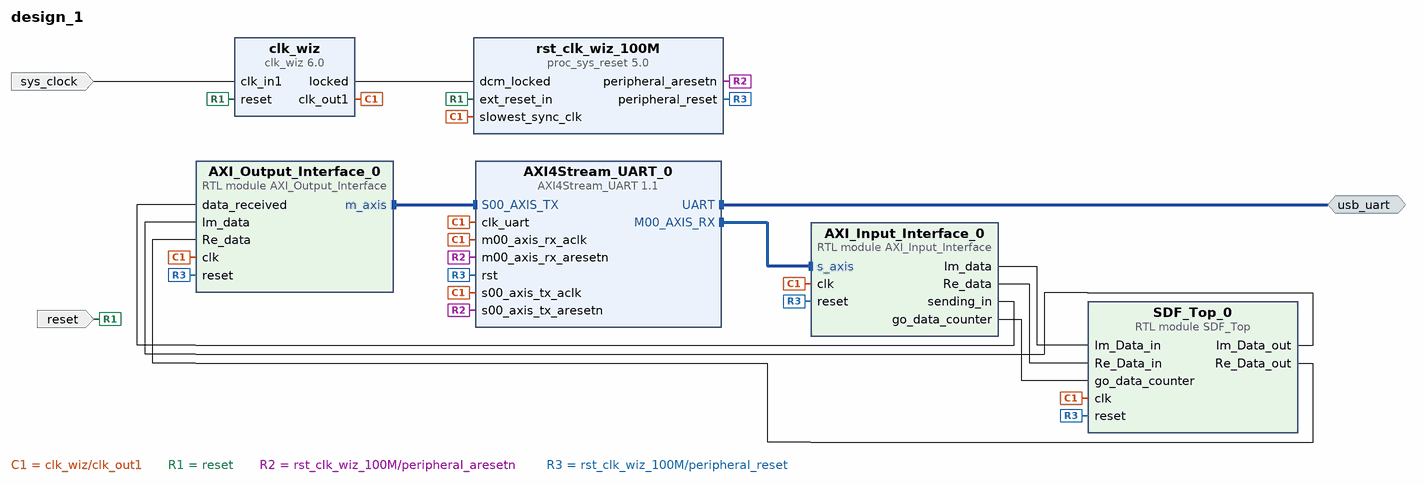
[diagram p0: block diagram of the top level]
# Vivado block design design_1, xc7a35tcpg236-1, Vivado 2022.1
create_bd_design design_1

create_bd_intf_port -mode Master -vlnv xilinx.com:interface:uart_rtl:1.0 usb_uart
create_bd_port -dir I -type clk sys_clock
set_property -dict {CONFIG.FREQ_HZ 100000000 CONFIG.PHASE 0.0} [get_bd_ports sys_clock]
create_bd_port -dir I -type rst reset
set_property -dict {CONFIG.POLARITY ACTIVE_HIGH} [get_bd_ports reset]

create_bd_cell -type ip -vlnv xilinx.com:ip:clk_wiz:6.0 clk_wiz
set_property -dict [list \
  CONFIG.CLKOUT1_JITTER 130.958 \
  CONFIG.CLKOUT1_PHASE_ERROR 98.575 \
  CONFIG.CLKOUT1_REQUESTED_OUT_FREQ 100.000 \
  CONFIG.CLK_IN1_BOARD_INTERFACE sys_clock \
  CONFIG.MMCM_CLKFBOUT_MULT_F 10.000 \
  CONFIG.MMCM_CLKOUT0_DIVIDE_F 10.000 \
  CONFIG.MMCM_DIVCLK_DIVIDE 1 \
  CONFIG.RESET_BOARD_INTERFACE reset \
  CONFIG.USE_BOARD_FLOW true \
] [get_bd_cells clk_wiz]
create_bd_cell -type ip -vlnv xilinx.com:ip:proc_sys_reset:5.0 rst_clk_wiz_100M
set_property -dict {CONFIG.RESET_BOARD_INTERFACE reset CONFIG.USE_BOARD_FLOW true} [get_bd_cells rst_clk_wiz_100M]
create_bd_cell -type ip -vlnv DigiLAB:ip:AXI4Stream_UART:1.1 AXI4Stream_UART_0
set_property -dict {CONFIG.UART_BOARD_INTERFACE usb_uart CONFIG.USE_BOARD_FLOW true} [get_bd_cells AXI4Stream_UART_0]
create_bd_cell -type module -reference AXI_Input_Interface AXI_Input_Interface_0
set_property -dict {CONFIG.DATA_WIDTH 8 CONFIG.FFT_TOT_POINTS 16} [get_bd_cells AXI_Input_Interface_0]
create_bd_cell -type module -reference AXI_Output_Interface AXI_Output_Interface_0
set_property -dict {CONFIG.DATA_WIDTH 8 CONFIG.FFT_TOT_POINTS 16} [get_bd_cells AXI_Output_Interface_0]
create_bd_cell -type module -reference SDF_Top SDF_Top_0
set_property -dict {CONFIG.DATA_WIDTH 8 CONFIG.FFT_TOT_POINTS 16 CONFIG.PRECISION 3} [get_bd_cells SDF_Top_0]

# ---- connections ----

connect_bd_intf_net [get_bd_intf_pins AXI_Input_Interface_0/s_axis] [get_bd_intf_pins AXI4Stream_UART_0/M00_AXIS_RX]
connect_bd_intf_net [get_bd_intf_ports usb_uart] [get_bd_intf_pins AXI4Stream_UART_0/UART]
connect_bd_intf_net [get_bd_intf_pins AXI4Stream_UART_0/S00_AXIS_TX] [get_bd_intf_pins AXI_Output_Interface_0/m_axis]
connect_bd_net [get_bd_pins AXI_Input_Interface_0/Im_data] [get_bd_pins SDF_Top_0/Im_Data_in]
connect_bd_net [get_bd_pins AXI_Input_Interface_0/Re_data] [get_bd_pins SDF_Top_0/Re_Data_in]
connect_bd_net [get_bd_pins AXI_Input_Interface_0/go_data_counter] [get_bd_pins SDF_Top_0/go_data_counter]
connect_bd_net [get_bd_pins AXI_Input_Interface_0/sending_in] [get_bd_pins AXI_Output_Interface_0/data_received]
connect_bd_net [get_bd_pins SDF_Top_0/Im_Data_out] [get_bd_pins AXI_Output_Interface_0/Im_data]
connect_bd_net [get_bd_pins SDF_Top_0/Re_Data_out] [get_bd_pins AXI_Output_Interface_0/Re_data]
connect_bd_net [get_bd_pins clk_wiz/clk_out1] \
  [get_bd_pins rst_clk_wiz_100M/slowest_sync_clk] [get_bd_pins AXI4Stream_UART_0/clk_uart] \
  [get_bd_pins AXI4Stream_UART_0/m00_axis_rx_aclk] [get_bd_pins AXI4Stream_UART_0/s00_axis_tx_aclk] \
  [get_bd_pins AXI_Input_Interface_0/clk] [get_bd_pins AXI_Output_Interface_0/clk] [get_bd_pins SDF_Top_0/clk]
connect_bd_net [get_bd_pins clk_wiz/locked] [get_bd_pins rst_clk_wiz_100M/dcm_locked]
connect_bd_net [get_bd_ports reset] [get_bd_pins rst_clk_wiz_100M/ext_reset_in] [get_bd_pins clk_wiz/reset]
connect_bd_net [get_bd_pins rst_clk_wiz_100M/peripheral_aresetn] \
  [get_bd_pins AXI4Stream_UART_0/m00_axis_rx_aresetn] [get_bd_pins AXI4Stream_UART_0/s00_axis_tx_aresetn]
connect_bd_net [get_bd_pins rst_clk_wiz_100M/peripheral_reset] \
  [get_bd_pins AXI4Stream_UART_0/rst] [get_bd_pins AXI_Input_Interface_0/reset] [get_bd_pins AXI_Output_Interface_0/reset] \
  [get_bd_pins SDF_Top_0/reset]
connect_bd_net [get_bd_ports sys_clock] [get_bd_pins clk_wiz/clk_in1]

validate_bd_design
save_bd_design
